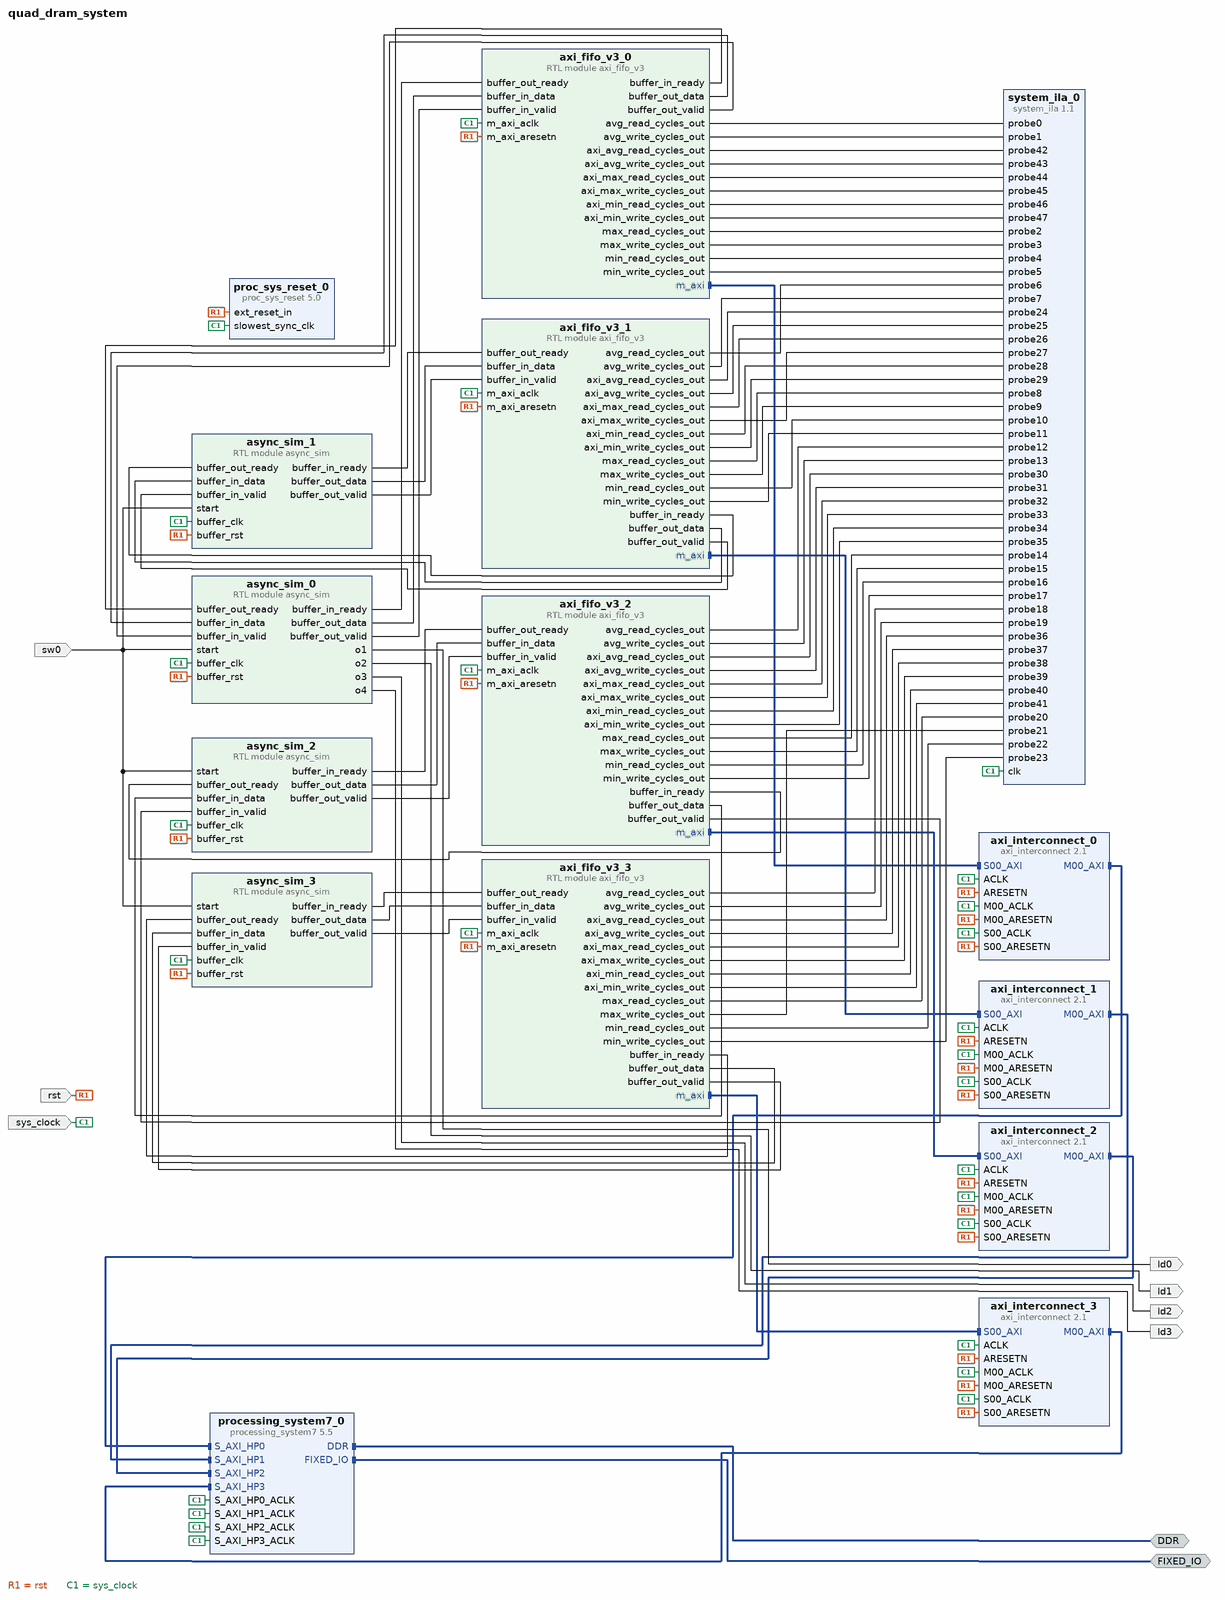
[diagram p0: block diagram of the top level]
# Vivado block design quad_dram_system, xc7z020clg400-1, Vivado 2022.2
create_bd_design quad_dram_system

create_bd_intf_port -mode Master -vlnv xilinx.com:interface:ddrx_rtl:1.0 DDR
create_bd_intf_port -mode Master -vlnv xilinx.com:display_processing_system7:fixedio_rtl:1.0 FIXED_IO
create_bd_port -dir O ld0
create_bd_port -dir O ld1
create_bd_port -dir O ld2
create_bd_port -dir O ld3
create_bd_port -dir I rst
create_bd_port -dir I sw0
create_bd_port -dir I -type clk sys_clock
set_property -dict {CONFIG.ASSOCIATED_RESET rst CONFIG.FREQ_HZ 100000000 CONFIG.PHASE 0.0} [get_bd_ports sys_clock]

create_bd_cell -type ip -vlnv xilinx.com:ip:axi_interconnect:2.1 axi_interconnect_0
set_property -dict [list \
  CONFIG.ENABLE_ADVANCED_OPTIONS 1 \
  CONFIG.NUM_MI 1 \
  CONFIG.NUM_SI 1 \
  CONFIG.S00_HAS_REGSLICE 3 \
] [get_bd_cells axi_interconnect_0]
create_bd_cell -type ip -vlnv xilinx.com:ip:axi_interconnect:2.1 axi_interconnect_1
set_property -dict {CONFIG.ENABLE_ADVANCED_OPTIONS 1 CONFIG.NUM_MI 1} [get_bd_cells axi_interconnect_1]
create_bd_cell -type ip -vlnv xilinx.com:ip:axi_interconnect:2.1 axi_interconnect_2
set_property -dict {CONFIG.ENABLE_ADVANCED_OPTIONS 1 CONFIG.NUM_MI 1} [get_bd_cells axi_interconnect_2]
create_bd_cell -type ip -vlnv xilinx.com:ip:proc_sys_reset:5.0 proc_sys_reset_0
create_bd_cell -type ip -vlnv xilinx.com:ip:processing_system7:5.5 processing_system7_0
set_property -dict [list \
  CONFIG.PCW_APU_PERIPHERAL_FREQMHZ 667 \
  CONFIG.PCW_ENET0_ENET0_IO {MIO 16 .. 27} \
  CONFIG.PCW_ENET0_GRP_MDIO_ENABLE 1 \
  CONFIG.PCW_ENET0_GRP_MDIO_IO {MIO 52 .. 53} \
  CONFIG.PCW_ENET0_PERIPHERAL_ENABLE 1 \
  CONFIG.PCW_ENET0_RESET_ENABLE 0 \
  CONFIG.PCW_ENET_RESET_ENABLE 1 \
  CONFIG.PCW_ENET_RESET_SELECT {Share reset pin} \
  CONFIG.PCW_EN_CLK0_PORT 0 \
  CONFIG.PCW_EN_RST0_PORT 0 \
  CONFIG.PCW_FPGA0_PERIPHERAL_FREQMHZ 50 \
  CONFIG.PCW_FPGA1_PERIPHERAL_FREQMHZ 50 \
  CONFIG.PCW_GPIO_MIO_GPIO_ENABLE 1 \
  CONFIG.PCW_GPIO_MIO_GPIO_IO MIO \
  CONFIG.PCW_I2C_RESET_ENABLE 0 \
  CONFIG.PCW_PERIPHERAL_BOARD_PRESET part0 \
  CONFIG.PCW_PRESET_BANK1_VOLTAGE {LVCMOS 1.8V} \
  CONFIG.PCW_QSPI_GRP_FBCLK_ENABLE 1 \
  CONFIG.PCW_QSPI_GRP_FBCLK_IO {MIO 8} \
  CONFIG.PCW_QSPI_GRP_SINGLE_SS_ENABLE 1 \
  CONFIG.PCW_QSPI_GRP_SINGLE_SS_IO {MIO 1 .. 6} \
  CONFIG.PCW_QSPI_PERIPHERAL_ENABLE 1 \
  CONFIG.PCW_QSPI_QSPI_IO {MIO 1 .. 6} \
  CONFIG.PCW_SD0_GRP_CD_ENABLE 1 \
  CONFIG.PCW_SD0_GRP_CD_IO {MIO 47} \
  CONFIG.PCW_SD0_GRP_WP_ENABLE 0 \
  CONFIG.PCW_SD0_PERIPHERAL_ENABLE 1 \
  CONFIG.PCW_SD0_SD0_IO {MIO 40 .. 45} \
  CONFIG.PCW_SDIO_PERIPHERAL_FREQMHZ 50 \
  CONFIG.PCW_SINGLE_QSPI_DATA_MODE x4 \
  CONFIG.PCW_S_AXI_HP0_DATA_WIDTH 32 \
  CONFIG.PCW_S_AXI_HP1_DATA_WIDTH 32 \
  CONFIG.PCW_S_AXI_HP2_DATA_WIDTH 32 \
  CONFIG.PCW_S_AXI_HP3_DATA_WIDTH 32 \
  CONFIG.PCW_UART1_PERIPHERAL_ENABLE 1 \
  CONFIG.PCW_UART1_UART1_IO {MIO 48 .. 49} \
  CONFIG.PCW_UART_PERIPHERAL_FREQMHZ 100 \
  CONFIG.PCW_UIPARAM_DDR_FREQ_MHZ 533.333333 \
  CONFIG.PCW_UIPARAM_DDR_MEMORY_TYPE {DDR 3 (Low Voltage)} \
  CONFIG.PCW_UIPARAM_DDR_PARTNO {MT41K256M16 RE-125} \
  CONFIG.PCW_USB0_PERIPHERAL_ENABLE 0 \
  CONFIG.PCW_USB_RESET_ENABLE 1 \
  CONFIG.PCW_USE_M_AXI_GP0 0 \
  CONFIG.PCW_USE_S_AXI_HP0 1 \
  CONFIG.PCW_USE_S_AXI_HP1 1 \
  CONFIG.PCW_USE_S_AXI_HP2 1 \
  CONFIG.PCW_USE_S_AXI_HP3 1 \
] [get_bd_cells processing_system7_0]
# 488 more settings of processing_system7_0 are not shown: defaults, MIO pin electricals, DDR timing, and values the tool derives
create_bd_cell -type ip -vlnv xilinx.com:ip:system_ila:1.1 system_ila_0
set_property -dict {CONFIG.C_MON_TYPE NATIVE CONFIG.C_NUM_OF_PROBES 48} [get_bd_cells system_ila_0]
create_bd_cell -type ip -vlnv xilinx.com:ip:axi_interconnect:2.1 axi_interconnect_3
set_property -dict {CONFIG.ENABLE_ADVANCED_OPTIONS 1 CONFIG.NUM_MI 1} [get_bd_cells axi_interconnect_3]
create_bd_cell -type module -reference async_sim async_sim_0
set_property -dict {CONFIG.NUM_REPS 10000 CONFIG.ram_width 34} [get_bd_cells async_sim_0]
create_bd_cell -type module -reference async_sim async_sim_1
set_property -dict {CONFIG.NUM_REPS 10000 CONFIG.ram_width 34} [get_bd_cells async_sim_1]
create_bd_cell -type module -reference async_sim async_sim_2
set_property -dict {CONFIG.NUM_REPS 10000 CONFIG.ram_width 34} [get_bd_cells async_sim_2]
create_bd_cell -type module -reference async_sim async_sim_3
set_property -dict {CONFIG.NUM_REPS 10000 CONFIG.ram_width 34} [get_bd_cells async_sim_3]
create_bd_cell -type module -reference axi_fifo_v3 axi_fifo_v3_0
set_property -dict [list \
  CONFIG.C_LENGTH_WIDTH 12 \
  CONFIG.DRAM_START_ADDRESS 0x00081000 \
  CONFIG.ram_depth 10 \
  CONFIG.ram_init 0 \
  CONFIG.ram_width 34 \
] [get_bd_cells axi_fifo_v3_0]
create_bd_cell -type module -reference axi_fifo_v3 axi_fifo_v3_1
set_property -dict [list \
  CONFIG.C_LENGTH_WIDTH 12 \
  CONFIG.DRAM_START_ADDRESS 0x00181100 \
  CONFIG.ram_depth 10 \
  CONFIG.ram_init 0 \
  CONFIG.ram_width 34 \
] [get_bd_cells axi_fifo_v3_1]
create_bd_cell -type module -reference axi_fifo_v3 axi_fifo_v3_2
set_property -dict [list \
  CONFIG.C_LENGTH_WIDTH 12 \
  CONFIG.DRAM_START_ADDRESS 0x00281200 \
  CONFIG.ram_depth 10 \
  CONFIG.ram_init 0 \
  CONFIG.ram_width 34 \
] [get_bd_cells axi_fifo_v3_2]
create_bd_cell -type module -reference axi_fifo_v3 axi_fifo_v3_3
set_property -dict [list \
  CONFIG.C_LENGTH_WIDTH 12 \
  CONFIG.DRAM_START_ADDRESS 0x00381300 \
  CONFIG.ram_depth 10 \
  CONFIG.ram_init 0 \
  CONFIG.ram_width 34 \
] [get_bd_cells axi_fifo_v3_3]

# ---- connections ----

connect_bd_intf_net -intf_net axi_fifo2_0_m_axi [get_bd_intf_pins axi_fifo_v3_0/m_axi] [get_bd_intf_pins axi_interconnect_0/S00_AXI]
connect_bd_intf_net [get_bd_intf_pins axi_fifo_v3_1/m_axi] [get_bd_intf_pins axi_interconnect_1/S00_AXI]
connect_bd_intf_net [get_bd_intf_pins axi_fifo_v3_2/m_axi] [get_bd_intf_pins axi_interconnect_2/S00_AXI]
connect_bd_intf_net [get_bd_intf_pins axi_fifo_v3_3/m_axi] [get_bd_intf_pins axi_interconnect_3/S00_AXI]
connect_bd_intf_net [get_bd_intf_pins axi_interconnect_0/M00_AXI] [get_bd_intf_pins processing_system7_0/S_AXI_HP0]
connect_bd_intf_net -intf_net axi_interconnect_0_M01_AXI [get_bd_intf_pins axi_interconnect_1/M00_AXI] [get_bd_intf_pins processing_system7_0/S_AXI_HP1]
connect_bd_intf_net [get_bd_intf_pins axi_interconnect_2/M00_AXI] [get_bd_intf_pins processing_system7_0/S_AXI_HP2]
connect_bd_intf_net [get_bd_intf_pins axi_interconnect_3/M00_AXI] [get_bd_intf_pins processing_system7_0/S_AXI_HP3]
connect_bd_intf_net [get_bd_intf_ports DDR] [get_bd_intf_pins processing_system7_0/DDR]
connect_bd_intf_net [get_bd_intf_ports FIXED_IO] [get_bd_intf_pins processing_system7_0/FIXED_IO]
connect_bd_net [get_bd_pins async_sim_0/buffer_in_ready] [get_bd_pins axi_fifo_v3_0/buffer_out_ready]
connect_bd_net [get_bd_pins async_sim_0/buffer_out_data] [get_bd_pins axi_fifo_v3_0/buffer_in_data]
connect_bd_net [get_bd_pins async_sim_0/buffer_out_valid] [get_bd_pins axi_fifo_v3_0/buffer_in_valid]
connect_bd_net [get_bd_pins async_sim_0/o1] [get_bd_ports ld0]
connect_bd_net [get_bd_pins async_sim_0/o2] [get_bd_ports ld1]
connect_bd_net [get_bd_pins async_sim_0/o3] [get_bd_ports ld2]
connect_bd_net [get_bd_pins async_sim_0/o4] [get_bd_ports ld3]
connect_bd_net [get_bd_pins async_sim_1/buffer_in_ready] [get_bd_pins axi_fifo_v3_1/buffer_out_ready]
connect_bd_net [get_bd_pins async_sim_1/buffer_out_data] [get_bd_pins axi_fifo_v3_1/buffer_in_data]
connect_bd_net [get_bd_pins async_sim_1/buffer_out_valid] [get_bd_pins axi_fifo_v3_1/buffer_in_valid]
connect_bd_net [get_bd_pins async_sim_2/buffer_in_ready] [get_bd_pins axi_fifo_v3_2/buffer_out_ready]
connect_bd_net [get_bd_pins async_sim_2/buffer_out_data] [get_bd_pins axi_fifo_v3_2/buffer_in_data]
connect_bd_net [get_bd_pins async_sim_2/buffer_out_valid] [get_bd_pins axi_fifo_v3_2/buffer_in_valid]
connect_bd_net [get_bd_pins async_sim_3/buffer_in_ready] [get_bd_pins axi_fifo_v3_3/buffer_out_ready]
connect_bd_net [get_bd_pins async_sim_3/buffer_out_data] [get_bd_pins axi_fifo_v3_3/buffer_in_data]
connect_bd_net [get_bd_pins async_sim_3/buffer_out_valid] [get_bd_pins axi_fifo_v3_3/buffer_in_valid]
connect_bd_net [get_bd_pins axi_fifo_v3_0/avg_read_cycles_out] [get_bd_pins system_ila_0/probe0]
connect_bd_net [get_bd_pins axi_fifo_v3_0/avg_write_cycles_out] [get_bd_pins system_ila_0/probe1]
connect_bd_net [get_bd_pins axi_fifo_v3_0/axi_avg_read_cycles_out] [get_bd_pins system_ila_0/probe42]
connect_bd_net [get_bd_pins axi_fifo_v3_0/axi_avg_write_cycles_out] [get_bd_pins system_ila_0/probe43]
connect_bd_net [get_bd_pins axi_fifo_v3_0/axi_max_read_cycles_out] [get_bd_pins system_ila_0/probe44]
connect_bd_net [get_bd_pins axi_fifo_v3_0/axi_max_write_cycles_out] [get_bd_pins system_ila_0/probe45]
connect_bd_net [get_bd_pins axi_fifo_v3_0/axi_min_read_cycles_out] [get_bd_pins system_ila_0/probe46]
connect_bd_net [get_bd_pins axi_fifo_v3_0/axi_min_write_cycles_out] [get_bd_pins system_ila_0/probe47]
connect_bd_net [get_bd_pins axi_fifo_v3_0/buffer_in_ready] [get_bd_pins async_sim_0/buffer_out_ready]
connect_bd_net [get_bd_pins axi_fifo_v3_0/buffer_out_data] [get_bd_pins async_sim_0/buffer_in_data]
connect_bd_net [get_bd_pins axi_fifo_v3_0/buffer_out_valid] [get_bd_pins async_sim_0/buffer_in_valid]
connect_bd_net [get_bd_pins axi_fifo_v3_0/max_read_cycles_out] [get_bd_pins system_ila_0/probe2]
connect_bd_net [get_bd_pins axi_fifo_v3_0/max_write_cycles_out] [get_bd_pins system_ila_0/probe3]
connect_bd_net [get_bd_pins axi_fifo_v3_0/min_read_cycles_out] [get_bd_pins system_ila_0/probe4]
connect_bd_net [get_bd_pins axi_fifo_v3_0/min_write_cycles_out] [get_bd_pins system_ila_0/probe5]
connect_bd_net [get_bd_pins axi_fifo_v3_1/avg_read_cycles_out] [get_bd_pins system_ila_0/probe6]
connect_bd_net [get_bd_pins axi_fifo_v3_1/avg_write_cycles_out] [get_bd_pins system_ila_0/probe7]
connect_bd_net [get_bd_pins axi_fifo_v3_1/axi_avg_read_cycles_out] [get_bd_pins system_ila_0/probe24]
connect_bd_net [get_bd_pins axi_fifo_v3_1/axi_avg_write_cycles_out] [get_bd_pins system_ila_0/probe25]
connect_bd_net [get_bd_pins axi_fifo_v3_1/axi_max_read_cycles_out] [get_bd_pins system_ila_0/probe26]
connect_bd_net [get_bd_pins axi_fifo_v3_1/axi_max_write_cycles_out] [get_bd_pins system_ila_0/probe27]
connect_bd_net [get_bd_pins axi_fifo_v3_1/axi_min_read_cycles_out] [get_bd_pins system_ila_0/probe28]
connect_bd_net [get_bd_pins axi_fifo_v3_1/axi_min_write_cycles_out] [get_bd_pins system_ila_0/probe29]
connect_bd_net [get_bd_pins axi_fifo_v3_1/buffer_in_ready] [get_bd_pins async_sim_1/buffer_out_ready]
connect_bd_net [get_bd_pins axi_fifo_v3_1/buffer_out_data] [get_bd_pins async_sim_1/buffer_in_data]
connect_bd_net [get_bd_pins axi_fifo_v3_1/buffer_out_valid] [get_bd_pins async_sim_1/buffer_in_valid]
connect_bd_net [get_bd_pins axi_fifo_v3_1/max_read_cycles_out] [get_bd_pins system_ila_0/probe8]
connect_bd_net [get_bd_pins axi_fifo_v3_1/max_write_cycles_out] [get_bd_pins system_ila_0/probe9]
connect_bd_net [get_bd_pins axi_fifo_v3_1/min_read_cycles_out] [get_bd_pins system_ila_0/probe10]
connect_bd_net [get_bd_pins axi_fifo_v3_1/min_write_cycles_out] [get_bd_pins system_ila_0/probe11]
connect_bd_net [get_bd_pins axi_fifo_v3_2/avg_read_cycles_out] [get_bd_pins system_ila_0/probe12]
connect_bd_net [get_bd_pins axi_fifo_v3_2/avg_write_cycles_out] [get_bd_pins system_ila_0/probe13]
connect_bd_net [get_bd_pins axi_fifo_v3_2/axi_avg_read_cycles_out] [get_bd_pins system_ila_0/probe30]
connect_bd_net [get_bd_pins axi_fifo_v3_2/axi_avg_write_cycles_out] [get_bd_pins system_ila_0/probe31]
connect_bd_net [get_bd_pins axi_fifo_v3_2/axi_max_read_cycles_out] [get_bd_pins system_ila_0/probe32]
connect_bd_net [get_bd_pins axi_fifo_v3_2/axi_max_write_cycles_out] [get_bd_pins system_ila_0/probe33]
connect_bd_net [get_bd_pins axi_fifo_v3_2/axi_min_read_cycles_out] [get_bd_pins system_ila_0/probe34]
connect_bd_net [get_bd_pins axi_fifo_v3_2/axi_min_write_cycles_out] [get_bd_pins system_ila_0/probe35]
connect_bd_net [get_bd_pins axi_fifo_v3_2/buffer_in_ready] [get_bd_pins async_sim_2/buffer_out_ready]
connect_bd_net [get_bd_pins axi_fifo_v3_2/buffer_out_data] [get_bd_pins async_sim_2/buffer_in_data]
connect_bd_net [get_bd_pins axi_fifo_v3_2/buffer_out_valid] [get_bd_pins async_sim_2/buffer_in_valid]
connect_bd_net [get_bd_pins axi_fifo_v3_2/max_read_cycles_out] [get_bd_pins system_ila_0/probe14]
connect_bd_net [get_bd_pins axi_fifo_v3_2/max_write_cycles_out] [get_bd_pins system_ila_0/probe15]
connect_bd_net [get_bd_pins axi_fifo_v3_2/min_read_cycles_out] [get_bd_pins system_ila_0/probe16]
connect_bd_net [get_bd_pins axi_fifo_v3_2/min_write_cycles_out] [get_bd_pins system_ila_0/probe17]
connect_bd_net [get_bd_pins axi_fifo_v3_3/avg_read_cycles_out] [get_bd_pins system_ila_0/probe18]
connect_bd_net [get_bd_pins axi_fifo_v3_3/avg_write_cycles_out] [get_bd_pins system_ila_0/probe19]
connect_bd_net [get_bd_pins axi_fifo_v3_3/axi_avg_read_cycles_out] [get_bd_pins system_ila_0/probe36]
connect_bd_net [get_bd_pins axi_fifo_v3_3/axi_avg_write_cycles_out] [get_bd_pins system_ila_0/probe37]
connect_bd_net [get_bd_pins axi_fifo_v3_3/axi_max_read_cycles_out] [get_bd_pins system_ila_0/probe38]
connect_bd_net [get_bd_pins axi_fifo_v3_3/axi_max_write_cycles_out] [get_bd_pins system_ila_0/probe39]
connect_bd_net [get_bd_pins axi_fifo_v3_3/axi_min_read_cycles_out] [get_bd_pins system_ila_0/probe40]
connect_bd_net [get_bd_pins axi_fifo_v3_3/axi_min_write_cycles_out] [get_bd_pins system_ila_0/probe41]
connect_bd_net [get_bd_pins axi_fifo_v3_3/buffer_in_ready] [get_bd_pins async_sim_3/buffer_out_ready]
connect_bd_net [get_bd_pins axi_fifo_v3_3/buffer_out_data] [get_bd_pins async_sim_3/buffer_in_data]
connect_bd_net [get_bd_pins axi_fifo_v3_3/buffer_out_valid] [get_bd_pins async_sim_3/buffer_in_valid]
connect_bd_net [get_bd_pins axi_fifo_v3_3/max_read_cycles_out] [get_bd_pins system_ila_0/probe20]
connect_bd_net [get_bd_pins axi_fifo_v3_3/max_write_cycles_out] [get_bd_pins system_ila_0/probe21]
connect_bd_net [get_bd_pins axi_fifo_v3_3/min_read_cycles_out] [get_bd_pins system_ila_0/probe22]
connect_bd_net [get_bd_pins axi_fifo_v3_3/min_write_cycles_out] [get_bd_pins system_ila_0/probe23]
connect_bd_net -net proc_sys_reset_0_peripheral_aresetn [get_bd_ports rst] \
  [get_bd_pins axi_interconnect_0/ARESETN] [get_bd_pins axi_interconnect_0/S00_ARESETN] \
  [get_bd_pins axi_interconnect_0/M00_ARESETN] [get_bd_pins proc_sys_reset_0/ext_reset_in] \
  [get_bd_pins axi_interconnect_1/ARESETN] [get_bd_pins axi_interconnect_1/S00_ARESETN] \
  [get_bd_pins axi_interconnect_1/M00_ARESETN] [get_bd_pins axi_interconnect_2/ARESETN] \
  [get_bd_pins axi_interconnect_2/S00_ARESETN] [get_bd_pins axi_interconnect_2/M00_ARESETN] \
  [get_bd_pins axi_interconnect_3/ARESETN] [get_bd_pins axi_interconnect_3/M00_ARESETN] \
  [get_bd_pins axi_interconnect_3/S00_ARESETN] [get_bd_pins async_sim_0/buffer_rst] [get_bd_pins async_sim_1/buffer_rst] \
  [get_bd_pins async_sim_2/buffer_rst] [get_bd_pins async_sim_3/buffer_rst] [get_bd_pins axi_fifo_v3_0/m_axi_aresetn] \
  [get_bd_pins axi_fifo_v3_1/m_axi_aresetn] [get_bd_pins axi_fifo_v3_2/m_axi_aresetn] \
  [get_bd_pins axi_fifo_v3_3/m_axi_aresetn]
connect_bd_net -net sw0_1 [get_bd_ports sw0] \
  [get_bd_pins async_sim_0/start] [get_bd_pins async_sim_1/start] [get_bd_pins async_sim_2/start] \
  [get_bd_pins async_sim_3/start]
connect_bd_net [get_bd_ports sys_clock] \
  [get_bd_pins processing_system7_0/S_AXI_HP0_ACLK] [get_bd_pins axi_interconnect_0/ACLK] \
  [get_bd_pins axi_interconnect_0/S00_ACLK] [get_bd_pins axi_interconnect_0/M00_ACLK] \
  [get_bd_pins proc_sys_reset_0/slowest_sync_clk] [get_bd_pins processing_system7_0/S_AXI_HP1_ACLK] \
  [get_bd_pins axi_interconnect_1/ACLK] [get_bd_pins axi_interconnect_1/S00_ACLK] [get_bd_pins axi_interconnect_1/M00_ACLK] \
  [get_bd_pins axi_interconnect_2/ACLK] [get_bd_pins axi_interconnect_2/S00_ACLK] [get_bd_pins axi_interconnect_2/M00_ACLK] \
  [get_bd_pins processing_system7_0/S_AXI_HP2_ACLK] [get_bd_pins system_ila_0/clk] [get_bd_pins axi_interconnect_3/S00_ACLK] \
  [get_bd_pins axi_interconnect_3/ACLK] [get_bd_pins axi_interconnect_3/M00_ACLK] \
  [get_bd_pins processing_system7_0/S_AXI_HP3_ACLK] [get_bd_pins async_sim_0/buffer_clk] [get_bd_pins async_sim_1/buffer_clk] \
  [get_bd_pins async_sim_2/buffer_clk] [get_bd_pins async_sim_3/buffer_clk] [get_bd_pins axi_fifo_v3_0/m_axi_aclk] \
  [get_bd_pins axi_fifo_v3_1/m_axi_aclk] [get_bd_pins axi_fifo_v3_2/m_axi_aclk] [get_bd_pins axi_fifo_v3_3/m_axi_aclk]

# ---- address map ----
assign_bd_address -offset 0x00000000 -range 1G -target_address_space [get_bd_addr_spaces axi_fifo_v3_0/m_axi] [get_bd_addr_segs processing_system7_0/S_AXI_HP0/HP0_DDR_LOWOCM]
assign_bd_address -offset 0x00000000 -range 1G -target_address_space [get_bd_addr_spaces axi_fifo_v3_1/m_axi] [get_bd_addr_segs processing_system7_0/S_AXI_HP1/HP1_DDR_LOWOCM]
assign_bd_address -offset 0x00000000 -range 1G -target_address_space [get_bd_addr_spaces axi_fifo_v3_2/m_axi] [get_bd_addr_segs processing_system7_0/S_AXI_HP2/HP2_DDR_LOWOCM]
assign_bd_address -offset 0x00000000 -range 1G -target_address_space [get_bd_addr_spaces axi_fifo_v3_3/m_axi] [get_bd_addr_segs processing_system7_0/S_AXI_HP3/HP3_DDR_LOWOCM]

validate_bd_design
save_bd_design
